# Altium schematic sheet Placa_Main.SchDoc
size A4; SheetNumber: 1; SheetTotal: 1
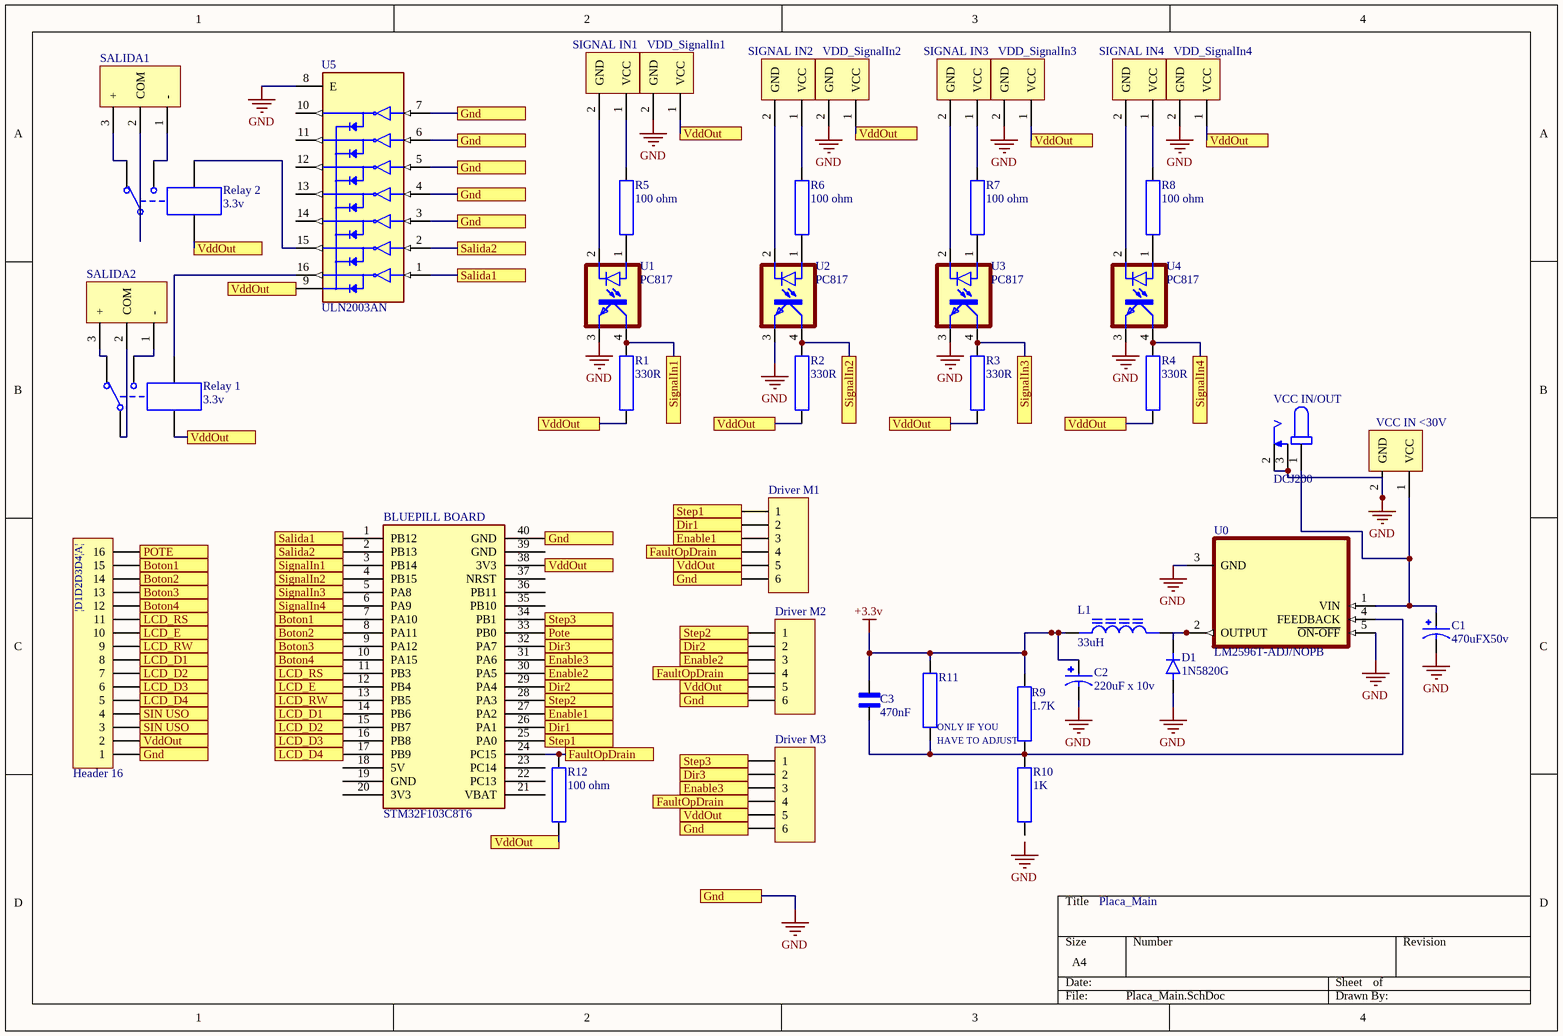
[diagram p0: Placa_Main.SchDoc]

## Parts
BLUEPILL_BOARD  STM32F103C8T6  [Stm32 BluePill]
C1  470uFX50v  [CAPPRD500W60D1000H2000]
C2  220uF x 10v  [CAPPRD250W45D800H500]
C3  470nF  [CERAMIC CAPACITOR]
D1  1N5820G  [DIOAD1990W125L900D530]
Driver_M1  (no value)  [HDR1X6]
Driver_M2  (no value)  [HDR1X6]
Driver_M3  (no value)  [HDR1X6]
L1  33uH  [IND_RLB9012-681KL]
R1  330R  [330R_P8mm_0.25W]
R2  330R  [330R_P8mm_0.25W]
R3  330R  [330R_P8mm_0.25W]
R4  330R  [330R_P8mm_0.25W]
R5  100 ohm  [330R_P8mm_0.25W]
R6  100 ohm  [330R_P8mm_0.25W]
R7  100 ohm  [330R_P8mm_0.25W]
R8  100 ohm  [330R_P8mm_0.25W]
R9  1.7K  [330R_P8mm_0.25W]
R10  1K  [330R_P8mm_0.25W]
R11  ONLY IF YOU  [330R_P8mm_0.25W]
R12  100 ohm  [330R_P8mm_0.25W]
Relay_1  3.3v  [MODULE5B]
Relay_2  3.3v  [MODULE5B]
SALIDA1  (no value)  [CONN3]
SALIDA2  (no value)  [CONN3]
SIGNAL_IN1  (no value)  [CONN2]
SIGNAL_IN2  (no value)  [CONN2]
SIGNAL_IN3  (no value)  [CONN2]
SIGNAL_IN4  (no value)  [CONN2]
U0  LM2596T-ADJ/NOPB  [TO170P1016X470X2092-5]
U1  PC817  [DIL04]
U2  PC817  [DIL04]
U3  PC817  [DIL04]
U4  PC817  [DIL04]
U5  ULN2003AN  [DIP794W45P254L1969H508Q16]
VCC_IN/OUT  DCJ200  [GCT_DCJ200-10-A-XX-K_REVA]
VCC_IN_<30V  (no value)  [CONN2]
VDD_SignalIn1  (no value)  [CONN2]
VDD_SignalIn2  (no value)  [CONN2]
VDD_SignalIn3  (no value)  [CONN2]
VDD_SignalIn4  (no value)  [CONN2]
|D1D2D3D4|A|  Header 16  [HDR1X16]

## Ports
Boton1, Boton2, Boton3, Boton4, Dir1, Dir2, Dir3, Enable1, Enable2, Enable3, FaultOpDrain, Gnd, LCD_D1, LCD_D2, LCD_D3, LCD_D4, LCD_E, LCD_RS, LCD_RW, POTE, Pote, Salida1, Salida2, SignalIn1, SignalIn2, SignalIn3, SignalIn4, SIN USO, Step1, Step2, Step3, VddOut

## Nets
+3.3v: C2.P C3.2 L1.1 R9.2 R11.2
GND: BLUEPILL_BOARD.40(GND) C1.N C2.N D1.A Driver_M1.6 Driver_M2.6 Driver_M3.6 U0.3(GND) U0.5(~{ON-OFF}) U1.3(EMIT) U2.3(EMIT) U3.3(EMIT) U4.3(EMIT) U5.3(3B) U5.4(4B) U5.5(5B) U5.6(6B) U5.7(7B) U5.8(E) VCC_IN/OUT.2 VCC_IN/OUT.3 VCC_IN_<30V.2(GND) VDD_SignalIn1.2(GND) VDD_SignalIn2.2(GND) VDD_SignalIn3.2(GND) VDD_SignalIn4.2(GND) |D1D2D3D4|A|.1 ; port Gnd
Boton1: BLUEPILL_BOARD.7(PA10) |D1D2D3D4|A|.15 ; port Boton1
Boton2: BLUEPILL_BOARD.8(PA11) |D1D2D3D4|A|.14 ; port Boton2
Boton3: BLUEPILL_BOARD.9(PA12) |D1D2D3D4|A|.13 ; port Boton3
Boton4: BLUEPILL_BOARD.10(PA15) |D1D2D3D4|A|.12 ; port Boton4
Dir1: BLUEPILL_BOARD.26(PA1) Driver_M1.2 ; port Dir1
Dir2: BLUEPILL_BOARD.29(PA4) Driver_M2.2 ; port Dir2
Dir3: BLUEPILL_BOARD.32(PA7) Driver_M3.2 ; port Dir3
Enable1: BLUEPILL_BOARD.27(PA2) Driver_M1.3 ; port Enable1
Enable2: BLUEPILL_BOARD.30(PA5) Driver_M2.3 ; port Enable2
Enable3: BLUEPILL_BOARD.31(PA6) Driver_M3.3 ; port Enable3
FaultOpDrain: BLUEPILL_BOARD.24(PC15) Driver_M1.4 Driver_M2.4 Driver_M3.4 R12.2 ; port FaultOpDrain
LCD_D1: BLUEPILL_BOARD.14(PB6) |D1D2D3D4|A|.8 ; port LCD_D1
LCD_D2: BLUEPILL_BOARD.15(PB7) |D1D2D3D4|A|.7 ; port LCD_D2
LCD_D3: BLUEPILL_BOARD.16(PB8) |D1D2D3D4|A|.6 ; port LCD_D3
LCD_D4: BLUEPILL_BOARD.17(PB9) |D1D2D3D4|A|.5 ; port LCD_D4
LCD_E: BLUEPILL_BOARD.12(PB4) |D1D2D3D4|A|.10 ; port LCD_E
LCD_RS: BLUEPILL_BOARD.11(PB3) |D1D2D3D4|A|.11 ; port LCD_RS
LCD_RW: BLUEPILL_BOARD.13(PB5) |D1D2D3D4|A|.9 ; port LCD_RW
POTE: BLUEPILL_BOARD.33(PB0) |D1D2D3D4|A|.16 ; port POTE, port Pote
Salida1: BLUEPILL_BOARD.1(PB12) U5.1(1B) ; port Salida1
Salida2: BLUEPILL_BOARD.2(PB13) U5.2(2B) ; port Salida2
SignalIn1: BLUEPILL_BOARD.3(PB14) R1.2 U1.4(COL) ; port SignalIn1
SignalIn2: BLUEPILL_BOARD.4(PB15) R2.2 U2.4(COL) ; port SignalIn2
SignalIn3: BLUEPILL_BOARD.5(PA8) R3.2 U3.4(COL) ; port SignalIn3
SignalIn4: BLUEPILL_BOARD.6(PA9) R4.2 U4.4(COL) ; port SignalIn4
SIN USO: |D1D2D3D4|A|.3 |D1D2D3D4|A|.4 ; port SIN USO
Step1: BLUEPILL_BOARD.25(PA0) Driver_M1.1 ; port Step1
Step2: BLUEPILL_BOARD.28(PA3) Driver_M2.1 ; port Step2
Step3: BLUEPILL_BOARD.34(PB1) Driver_M3.1 ; port Step3
VddOut: BLUEPILL_BOARD.38(3V3) Driver_M1.5 Driver_M2.5 Driver_M3.5 R1.1 R2.1 R3.1 R4.1 R12.1 Relay_1.4 Relay_2.4 U5.9(COM) VDD_SignalIn1.1(VCC) VDD_SignalIn2.1(VCC) VDD_SignalIn3.1(VCC) VDD_SignalIn4.1(VCC) |D1D2D3D4|A|.2 ; port VddOut
NetC1_P: C1.P U0.1(VIN) VCC_IN/OUT.1 VCC_IN_<30V.1(VCC)
NetC3_1: C3.1 R9.1 R10.2 R11.1 U0.4(FEEDBACK)
NetD1_C: D1.C(K) L1.2 U0.2(OUTPUT)
NetR5_1: R5.1 U1.1(A)
NetR5_2: R5.2 SIGNAL_IN1.1(VCC)
NetR6_1: R6.1 U2.1(A)
NetR6_2: R6.2 SIGNAL_IN2.1(VCC)
NetR7_1: R7.1 U3.1(A)
NetR7_2: R7.2 SIGNAL_IN3.1(VCC)
NetR8_1: R8.1 U4.1(A)
NetR8_2: R8.2 SIGNAL_IN4.1(VCC)
NetRelay_1_1: Relay_1.1 SALIDA2.2(COM)
NetRelay_1_2: Relay_1.2 SALIDA2.3(+)
NetRelay_1_3: Relay_1.3 SALIDA2.1(-)
NetRelay_1_5: Relay_1.5 U5.16(1C)
NetRelay_2_1: Relay_2.1 SALIDA1.2(COM)
NetRelay_2_2: Relay_2.2 SALIDA1.3(+)
NetRelay_2_3: Relay_2.3 SALIDA1.1(-)
NetRelay_2_5: Relay_2.5 U5.15(2C)
NetSIGNAL_IN1_2: SIGNAL_IN1.2(GND) U1.2(C)
NetSIGNAL_IN2_2: SIGNAL_IN2.2(GND) U2.2(C)
NetSIGNAL_IN3_2: SIGNAL_IN3.2(GND) U3.2(C)
NetSIGNAL_IN4_2: SIGNAL_IN4.2(GND) U4.2(C)

Not connected (* = marked no-connect by the designer): BLUEPILL_BOARD 18(5V) 19(GND) 20(3V3) 21(VBAT) 22(PC13) 23(PC14) 35(PB10) 36(PB11) 37(NRST) 39(GND); R10 1; U5 10(7C) 11(6C) 12(5C) 13(4C) 14(3C)

## Notes on the sheet
- HAVE TO ADJUST
- Placa_Main
- Labels drawn without touching a wire or pin: GND

## Library data of the parts
BLUEPILL_BOARD = BluePill: Designed By @Alixahedi
C1 = CAP-470uFX50v: 470ÂµF 50V Aluminum Electrolytic Capacitors Radial, Can 2000 Hrs @ 105Â°C; MP: EEUHD1H471; MF: Panasonic; Value: *; SnapEDA_Link: https://www.snapeda.com/parts/EEUHD1H471/Panasonic/view-part/5785983/?ref=snap; Availability: Not in stock; Package: RADIAL-2 Panasonic; Price: None; Check_prices: https://www.snapeda.com/parts/EEUHD1H471/Panasonic/view-part/5785983/?ref=eda
C2 = ECEA1AKS221I: CAP ALUM 220UF 20% 10V RADIAL; MF: Panasonic; MP: ECE-A1AKS221I; Check_prices: https://www.snapeda.com/parts/ECE-A1AKS221I/Panasonic/view-part/2339032/?ref=eda; Availability: In Stock; Value: *; Price: None; Purchase-URL: https://pricing.snapeda.com/search/part/ECE-A1AKS221I/?ref=eda; Package: RADIAL-2 Panasonic; SnapEDA_Link: https://www.snapeda.com/parts/ECE-A1AKS221I/Panasonic/view-part/2339032/?ref=snap
C3 = SR655C474MARTR1: SR Series 7.62 x 7.62 mm 470 nF 50 V Â±20 % Tolerance X7R Radial Lead/SkyCapÂ®; MF: AVX; SnapEDA_Link: https://www.snapeda.com/parts/SR655C474MARTR1/AVX/view-part/?ref=snap; Package: Radial AVX; Value: *; MP: SR655C474MARTR1; Check_prices: https://www.snapeda.com/parts/SR655C474MARTR1/AVX/view-part/?ref=eda
D1 = 1N5820G: ON Semi 1N5820G, Schottky Diode, 20V 3A, 2-Pin DO-201AD | ON Semiconductor 1N5820G; SnapEDA_Link: https://www.snapeda.com/parts/1N5820G/Onsemi/view-part/?ref=snap; Package: AXIAL LEAD-2 ON Semiconductor; Value: *; MF: ON Semiconductor; MP: 1N5820G; Check_prices: https://www.snapeda.com/parts/1N5820G/Onsemi/view-part/?ref=eda
Driver_M1-Driver_M3 = Header 6: step,dir,enable,fault,vdd; LatestRevisionDate: 17-Jul-2002; LatestRevisionNote: Re-released for DXP Platform.; Publisher: Altium Limited
L1 = RLB9012-681KL: Availability: Unavailable; MP: RLB9012-681KL; Price: None; Value: *; Package: None
R1-R12 = 330R_0.25W
Relay_1 Relay_2 = Relay-SPDT: Single-Pole Dual-Throw Relay; Published: 24-Mar-1999; LatestRevisionDate: 17-Jul-2002; LatestRevisionNote: Re-released for DXP Platform.; PackageReference: MODULE5B; Publisher: Altium Limited
SALIDA1 SALIDA2 = Bornera_3C
SIGNAL_IN1-SIGNAL_IN4 VCC_IN_<30V VDD_SignalIn1-VDD_SignalIn4 = Bornera_2C
U0 = LM2596T-ADJ/NOPB: SIMPLE SWITCHERÂ® 4.5V to 40V, 3A Low Component Count Step-Down Regulator; MF: Texas Instruments; SnapEDA_Link: https://www.snapeda.com/parts/LM2596T-ADJ/NOPB/Texas+Instruments/view-part/?ref=snap; Package: TO-220-5 Texas Instruments; Value: *; MP: LM2596T-ADJ/NOPB; Check_prices: https://www.snapeda.com/parts/LM2596T-ADJ/NOPB/Texas+Instruments/view-part/?ref=eda
U1-U4 = PC817X3NSZ9F: Optoisolator Transistor Output 5000Vrms 1 Channel 4-DIP; MF: Sharp Microelectronics; SnapEDA_Link: https://www.snapeda.com/parts/PC817X3NSZ9F/Sharp+Microelectronics/view-part/?ref=snap; Package: DIP-4 Sharp Microelectronics; Value: *; MP: PC817X3NSZ9F; Check_prices: https://www.snapeda.com/parts/PC817X3NSZ9F/Sharp+Microelectronics/view-part/?ref=eda
U5 = ULN2003AN: 50-V, 7-ch darlington transistor array, -20C to 70C; MF: Texas Instruments; SnapEDA_Link: https://www.snapeda.com/parts/ULN2003AN/Texas+Instruments/view-part/?ref=snap; Package: PDIP-16 Texas Instruments; Value: *; MP: ULN2003AN; Check_prices: https://www.snapeda.com/parts/ULN2003AN/Texas+Instruments/view-part/?ref=eda
VCC_IN/OUT = DCJ200-10-A-XX-K_REVA: Power Barrel Connector Jack 2.05mm ID (0.081), 5.50mm OD (0.217) Through Hole, Right Angle; MF: Global Connector Technology; MP: DCJ200-10-A-K1-K; SnapEDA_Link: https://www.snapeda.com/parts/DCJ200-10-A-K1-K/Global+Connector+Technology/view-part/?ref=snap; Package: None; Value: *; Check_prices: https://www.snapeda.com/parts/DCJ200-10-A-K1-K/Global+Connector+Technology/view-part/?ref=eda
|D1D2D3D4|A| = Header 16: Header, 16-Pin; LatestRevisionDate: 17-Jul-2002; LatestRevisionNote: Re-released for DXP Platform.; Publisher: Altium Limited